# EAGLE schematic ENGI301_sun_clock (EAGLE 9.5.1)
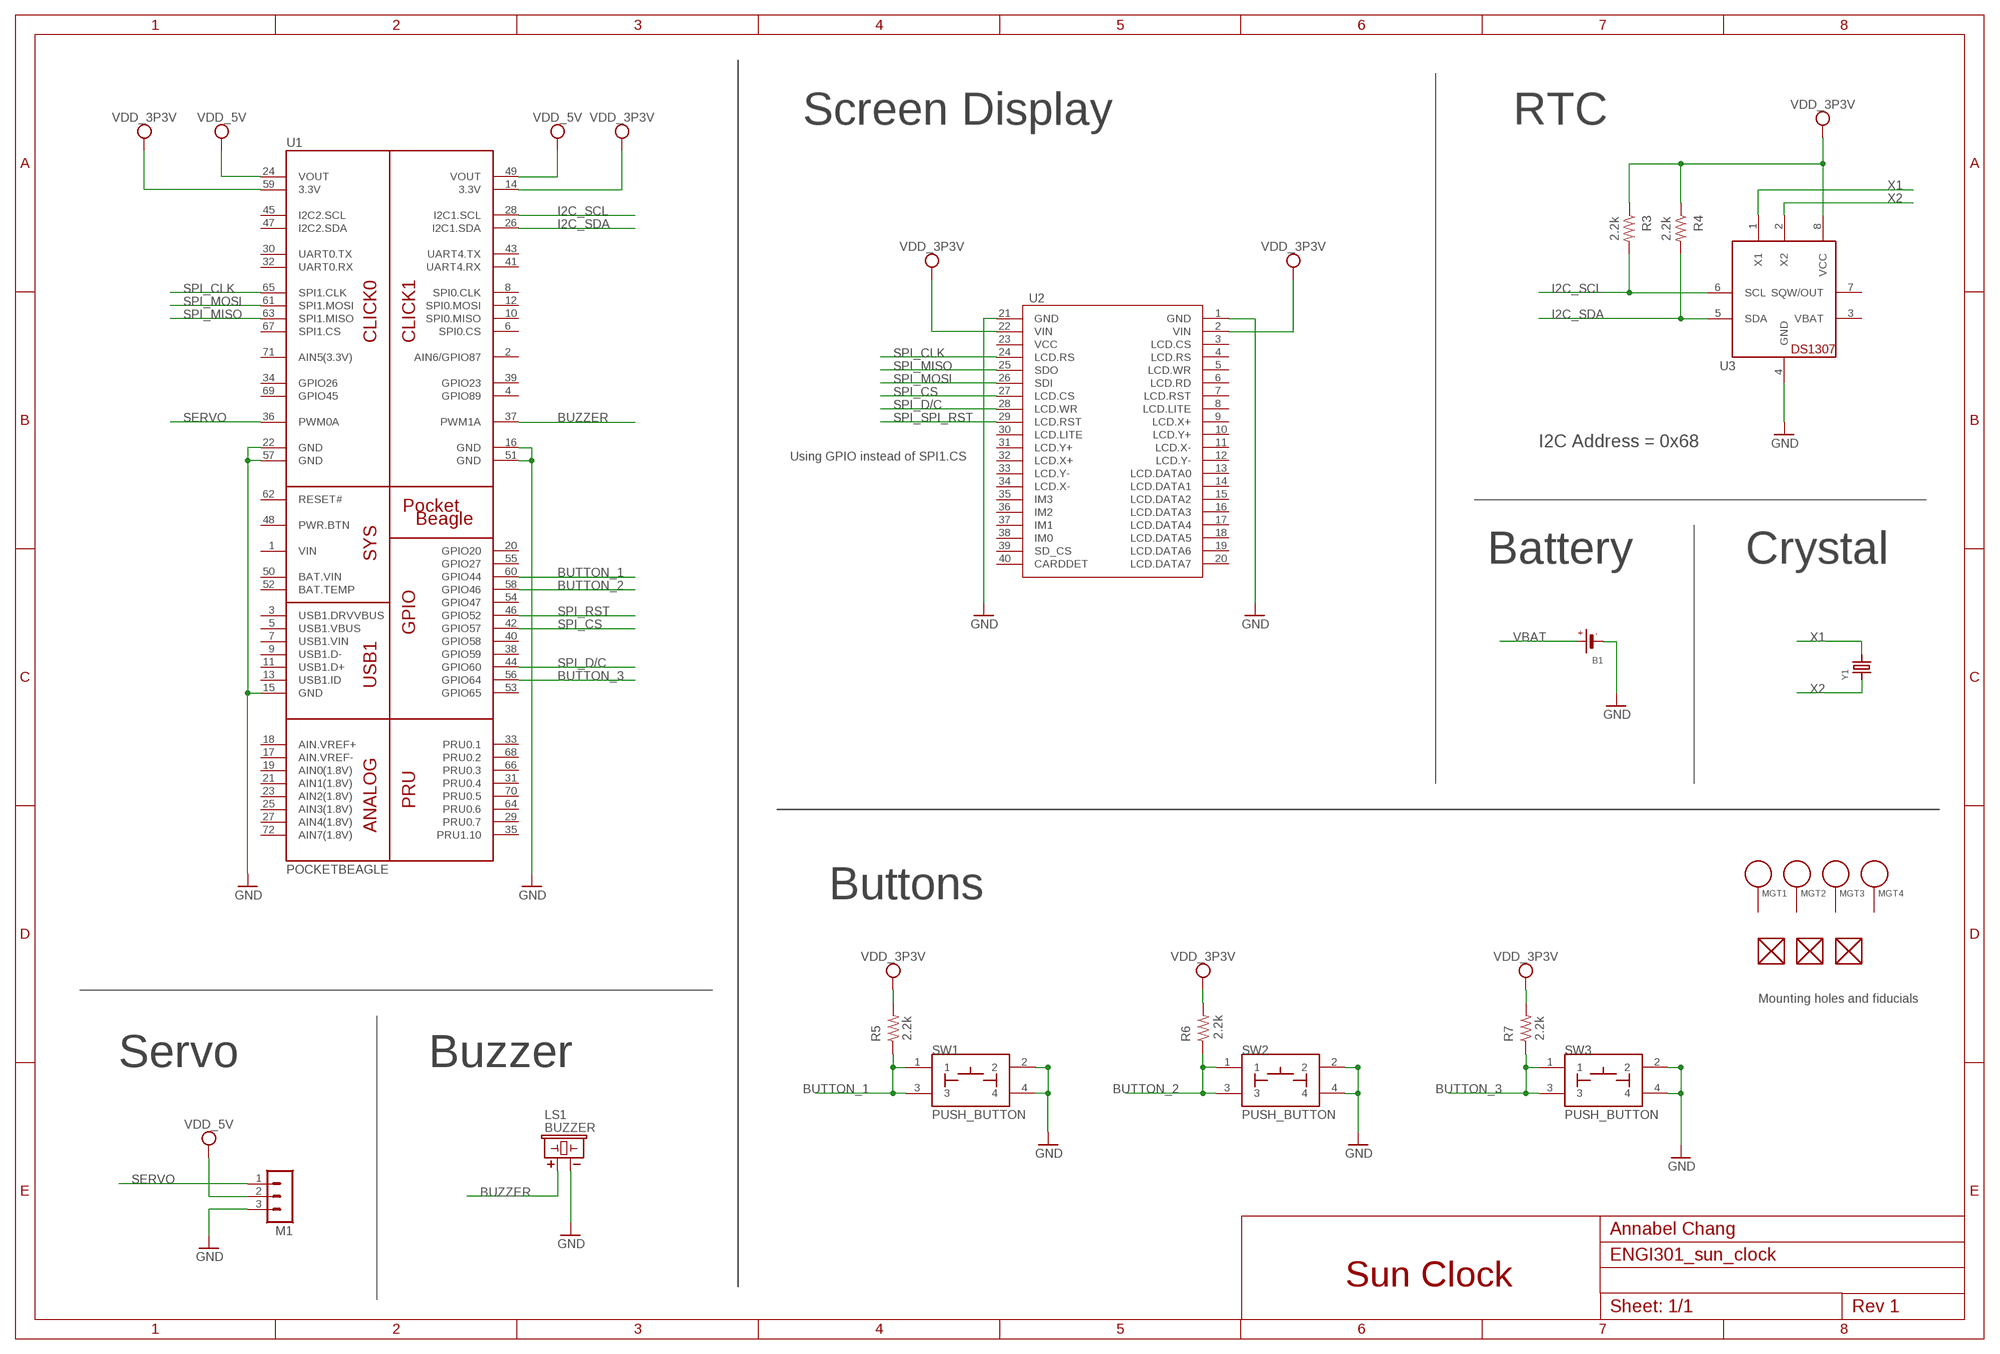
[diagram p0: schematic, sheet 1]

## Parts
B1  BATTERYCR1220_SMT  [CR1220]
FUD1  FIDUCIAL  [FIDUCIAL_40MIL]
FUD2  FIDUCIAL  [FIDUCIAL_40MIL]
FUD3  FIDUCIAL  [FIDUCIAL_40MIL]
LS1  BUZZER  [BUZZER_6.5MM]
M1  MA03-1  [MA03-1]
MGT1  MOUNTING_HOLE  [MOUNTING_HOLE]
MGT2  MOUNTING_HOLE  [MOUNTING_HOLE]
MGT3  MOUNTING_HOLE  [MOUNTING_HOLE]
MGT4  MOUNTING_HOLE  [MOUNTING_HOLE]
R3  2.2k  R_R0805  [R0805]
R4  2.2k  R_R0805  [R0805]
R5  2.2k  R_R0603  [R0603]
R6  2.2k  R_R0603  [R0603]
R7  2.2k  R_R0603  [R0603]
SW1  PUSH_BUTTON  [BUTTON_12.5MM]
SW2  PUSH_BUTTON  [BUTTON_12.5MM]
SW3  PUSH_BUTTON  [BUTTON_12.5MM]
U1  POCKETBEAGLE  [POCKETBEAGLE]
U2  DISP_LCD_2.8IN  [DISP_LCD_2.8IN]
U3  DS1307  [DIL08]
Y1  CRYSTAL8.0X3.8  [CRYSTAL_8X3.8]

## Nets
BUTTON_1: R5.1 SW1.1 SW1.3 U1.60(GPIO44)
BUTTON_2: R6.1 SW2.1 SW2.3 U1.58(GPIO46)
BUTTON_3: R7.1 SW3.1 SW3.3 U1.56(GPIO64)
BUZZER: LS1.+ U1.37(PWM1A)
GND: B1.- LS1.- M1.3 SW1.2 SW1.4 SW2.2 SW2.4 SW3.2 SW3.4 U1.15(GND) U1.16(GND) U1.22(GND) U1.51(GND) U1.57(GND) U2.1(GND) U2.21(GND) U3.4(GND)
I2C_SCL: R3.2 U1.28(I2C1.SCL) U3.6(SCL)
I2C_SDA: R4.2 U1.26(I2C1.SDA) U3.5(SDA)
SERVO: M1.1 U1.36(PWM0A)
SPI_CLK: U1.65(SPI1.CLK) U2.24(LCD.RS)
SPI_CS: U1.42(GPIO57) U2.27(LCD.CS)
SPI_D/C: U1.44(GPIO60) U2.28(LCD.WR)
SPI_MISO: U1.63(SPI1.MISO) U2.25(SDO)
SPI_MOSI: U1.61(SPI1.MOSI) U2.26(SDI)
SPI_RST: U1.46(GPIO52)
SPI_SPI_RST: U2.29(LCD.RST)
VBAT: B1.+$1(+)
VDD_3P3V: R3.1 R4.1 R5.2 R6.2 R7.2 U1.14(3.3V) U1.59(3.3V) U2.2(VIN) U2.22(VIN) U3.8(VCC)
VDD_5V: M1.2 U1.24(VOUT) U1.49(VOUT)
X1: U3.1(X1) Y1.P$4
X2: U3.2(X2) Y1.P$1
Unconnected: FUD1.P$1 FUD2.P$1 FUD3.P$1 MGT1.P$1 MGT2.P$1 MGT3.P$1 MGT4.P$1 U1.2(AIN6/GPIO87) U1.3(USB1.DRVVBUS) U1.4(GPIO89) U1.5(USB1.VBUS) U1.6(SPI0.CS) U1.7(USB1.VIN) U1.8(SPI0.CLK) U1.9(USB1.D-) U1.10(SPI0.MISO) U1.11(USB1.D+) U1.12(SPI0.MOSI) U1.13(USB1.ID) U1.17(AIN.VREF-) U1.18(AIN.VREF+) U1.19(AIN0(1.8V)) U1.20(GPIO20) U1.21(AIN1(1.8V)) U1.23(AIN2(1.8V)) U1.25(AIN3(1.8V)) U1.27(AIN4(1.8V)) U1.29(PRU0.7) U1.30(UART0.TX) U1.31(PRU0.4) U1.32(UART0.RX) U1.33(PRU0.1) U1.34(GPIO26) U1.35(PRU1.10) U1.38(GPIO59) U1.39(GPIO23) U1.40(GPIO58) U1.41(UART4.RX) U1.43(UART4.TX) U1.45(I2C2.SCL) U1.47(I2C2.SDA) U1.48(PWR.BTN) U1.52(BAT.TEMP) U1.53(GPIO65) U1.54(GPIO47) U1.55(GPIO27) U1.62(RESET#) U1.64(PRU0.6) U1.66(PRU0.3) U1.67(SPI1.CS) U1.68(PRU0.2) U1.69(GPIO45) U1.70(PRU0.5) U1.71(AIN5(3.3V)) U1.72(AIN7(1.8V)) U2.3(LCD.CS) U2.4(LCD.RS) U2.5(LCD.WR) U2.6(LCD.RD) U2.7(LCD.RST) U2.8(LCD.LITE) U2.9(LCD.X+) U2.10(LCD.Y+) U2.11(LCD.X-) U2.12(LCD.Y-) U2.13(LCD.DATA0) U2.14(LCD.DATA1) U2.15(LCD.DATA2) U2.16(LCD.DATA3) U2.17(LCD.DATA4) U2.18(LCD.DATA5) U2.19(LCD.DATA6) U2.20(LCD.DATA7) U2.23(VCC) U2.30(LCD.LITE) U2.31(LCD.Y+) U2.32(LCD.X+) U2.33(LCD.Y-) U2.34(LCD.X-) U2.35(IM3) U2.36(IM2) U2.37(IM1) U2.38(IM0) U2.39(SD_CS) U2.40(CARDDET) U3.7(SQW/OUT)

## Notes on the sheet
- Screen Display | RTC
- I2C Address = 0x68
- Using GPIO instead of SPI1.CS
- Battery | Crystal
- Buttons
- Mounting holes and fiducials
- Servo | Buzzer
- Annabel Chang
- Sun Clock
- 1/1

## Power pins joined to a net without a drawn wire
BAT.VIN: U1.50(BAT.VIN)
VBAT: U3.3(VBAT)
VIN: U1.1(VIN)

## Library data of the parts
B1 = ENGI_301_sun_clock:BATTERY: CR1220 SMT - Digikey: 3001K-ND CD2032 BAT-HLD-001 - Digikey: BAT-HLD-001-ND
FUD1-FUD3 = ENGI_301_sun_clock:FIDUCIAL
LS1 = ENGI_301_sun_clock:BUZZER: CEM-1203 Buzzer
M1 = ENGI_301_sun_clock:MA03-1: PIN HEADER for HS-422 Servo Motor; OC_FARNELL: unknown; OC_NEWARK: unknown
MGT1-MGT4 = ENGI_301_sun_clock:MOUNTING_HOLE: Chassis Mounting Hole w/GND connection ability
R3-R7 = ENGI_301_sun_clock:R_: RESISTOR, American symbol
SW1-SW3 = ENGI_301_sun_clock:PUSH_BUTTON
U1 = ENGI_301_sun_clock:POCKETBEAGLE
U2 = ENGI_301_sun_clock:DISP_LCD_2.8IN: 2.8" TFT LCD with Touchscreen Breakout Board w/MicroSD Socket - ILI9341
U3 = ENGI_301_sun_clock:DS1307: DS1307 Real time clock (RTC) with battery backup ability. Talk to it via i2c
Y1 = ENGI_301_sun_clock:CRYSTAL: Crystals HC49UP - Surface Mount Crystal 4.0MHz 18pF +/-30ppm Surface Mount Crystal [Digikey: 535-9857-1-ND] 12.0 MHz Surface Mount Crystal [Digikey: 535-9869-6-ND] 25.0 MHz Surface Mount Crystal [Digikey: 535-9078-1-ND] 2.5 x 2.0mm - MEMs SMT Crystal 16.0 MHz 10pF 20ppm 2.5 x 2.0mm Crystal [Digikey -40-85°C: 535-10923-1-ND] 3.2 x 2.5mm - MEMs SMT Crystal 12.0 MHz 8pF 15ppm 3.2 x 2.5mm Crystal [Digikey: -10-70°C: 644-1047-1-ND -40-125°C: 644-1128-1-ND] 40~85°C cheaper: 644-1173-6-ND 16.0 MHz 8pF 15ppm 3.2 x 2.5mm Crystal [Digikey: -10-70°C: 644-1049-1-ND -40-125°C: 644-1129-2-ND]-40~85°C cheaper: 644-1175-6-ND 16.0 MHz 10pF 10ppm 3.2 x 2.5mm Crystal [Digikey: 644-1100-1-ND] 27.12 MHz 18pF 30ppm 3.2 x 2.5mm Crystal [Digikey: 887-1424-1-ND] 27.12MHz 10pF 10ppm 3.2 x 2.5mm Crystal [Digikey: 887-1329-1-ND] 4.9 x 1.8mm - MEMs SMT Crystal 32.768 KHz 12.5pF 20ppm 4.9 x 1.8mm Crystal [Digikey: SE2415CT-ND] 8.0 x 3.8mm - Surface Mount Crystal 32.768kHz 12.5pF 20ppm -40°C-85°C [Digikey: 535-9166-2-ND] Cylinder 32.768KHz Cylinder Crystal (2x6mm body) [Ex. Digikey: 300-8341-2-ND]